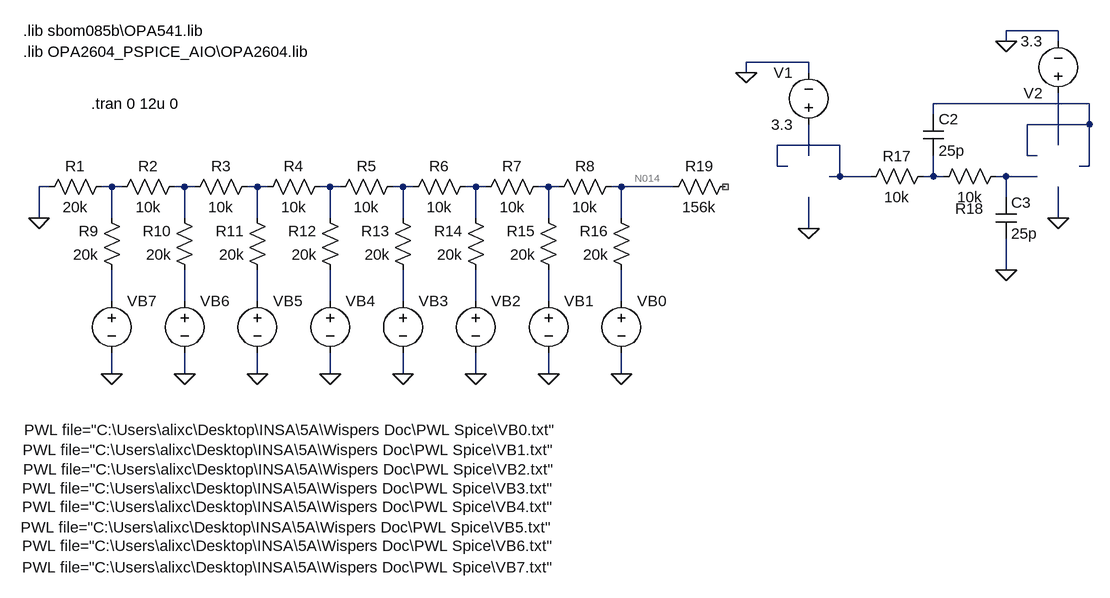
[diagram p0: schematic Transmission.asc]
Transmission.asc, the LTspice schematic file:
Version 4
SHEET 1 1856 1568
WIRE 1424 -128 1344 -128
WIRE 1344 -112 1344 -128
WIRE 1424 -112 1424 -128
WIRE 1040 -80 944 -80
WIRE 944 -64 944 -80
WIRE 1040 -64 1040 -80
WIRE 1472 -16 1232 -16
WIRE 1232 0 1232 -16
WIRE 1472 16 1472 -16
WIRE 1472 16 1376 16
WIRE 1088 48 992 48
WIRE 1424 48 1424 -32
WIRE 1040 64 1040 16
WIRE 1376 64 1376 16
WIRE 1392 64 1376 64
WIRE 992 80 992 48
WIRE 1008 80 992 80
WIRE 1472 80 1472 16
WIRE 1472 80 1456 80
WIRE 1088 96 1088 48
WIRE 1088 96 1072 96
WIRE 1136 96 1088 96
WIRE 1232 96 1232 64
WIRE 1232 96 1216 96
WIRE 1248 96 1232 96
WIRE 1344 96 1328 96
WIRE 1392 96 1344 96
WIRE -128 112 -144 112
WIRE -32 112 -48 112
WIRE -16 112 -32 112
WIRE 80 112 64 112
WIRE 96 112 80 112
WIRE 192 112 176 112
WIRE 208 112 192 112
WIRE 304 112 288 112
WIRE 320 112 304 112
WIRE 416 112 400 112
WIRE 432 112 416 112
WIRE 528 112 512 112
WIRE 544 112 528 112
WIRE 640 112 624 112
WIRE 656 112 640 112
WIRE 752 112 736 112
WIRE 832 112 752 112
WIRE 1344 128 1344 96
WIRE -144 160 -144 112
WIRE -32 160 -32 112
WIRE 80 160 80 112
WIRE 192 160 192 112
WIRE 304 160 304 112
WIRE 416 160 416 112
WIRE 528 160 528 112
WIRE 640 160 640 112
WIRE 752 160 752 112
WIRE 1424 160 1424 112
WIRE 1040 176 1040 128
WIRE 1344 240 1344 192
WIRE -32 288 -32 240
WIRE 80 288 80 240
WIRE 192 288 192 240
WIRE 304 288 304 240
WIRE 416 288 416 240
WIRE 528 288 528 240
WIRE 640 288 640 240
WIRE 752 288 752 240
WIRE -32 400 -32 368
WIRE 80 400 80 368
WIRE 192 400 192 368
WIRE 304 400 304 368
WIRE 416 400 416 368
WIRE 528 400 528 368
WIRE 640 400 640 368
WIRE 752 400 752 368
FLAG -144 160 0
FLAG 752 400 0
FLAG 640 400 0
FLAG 528 400 0
FLAG 416 400 0
FLAG 304 400 0
FLAG 192 400 0
FLAG 80 400 0
FLAG -32 400 0
FLAG 1344 240 0
FLAG 944 -64 0
FLAG 1344 -112 0
FLAG 1040 176 0
FLAG 1424 160 0
SYMBOL res -32 96 R90
WINDOW 0 0 56 VBottom 2
WINDOW 3 32 56 VTop 2
SYMATTR InstName R1
SYMATTR Value 20k
SYMBOL res 80 96 R90
WINDOW 0 0 56 VBottom 2
WINDOW 3 32 56 VTop 2
SYMATTR InstName R2
SYMATTR Value 10k
SYMBOL res 192 96 R90
WINDOW 0 0 56 VBottom 2
WINDOW 3 32 56 VTop 2
SYMATTR InstName R3
SYMATTR Value 10k
SYMBOL res 304 96 R90
WINDOW 0 0 56 VBottom 2
WINDOW 3 32 56 VTop 2
SYMATTR InstName R4
SYMATTR Value 10k
SYMBOL res 416 96 R90
WINDOW 0 0 56 VBottom 2
WINDOW 3 32 56 VTop 2
SYMATTR InstName R5
SYMATTR Value 10k
SYMBOL res 528 96 R90
WINDOW 0 0 56 VBottom 2
WINDOW 3 32 56 VTop 2
SYMATTR InstName R6
SYMATTR Value 10k
SYMBOL res 640 96 R90
WINDOW 0 0 56 VBottom 2
WINDOW 3 32 56 VTop 2
SYMATTR InstName R7
SYMATTR Value 10k
SYMBOL res 752 96 R90
WINDOW 0 0 56 VBottom 2
WINDOW 3 32 56 VTop 2
SYMATTR InstName R8
SYMATTR Value 10k
SYMBOL res -16 256 R180
WINDOW 0 36 76 Left 2
WINDOW 3 36 40 Left 2
SYMATTR InstName R9
SYMATTR Value 20k
SYMBOL res 96 256 R180
WINDOW 0 36 76 Left 2
WINDOW 3 36 40 Left 2
SYMATTR InstName R10
SYMATTR Value 20k
SYMBOL res 208 256 R180
WINDOW 0 36 76 Left 2
WINDOW 3 36 40 Left 2
SYMATTR InstName R11
SYMATTR Value 20k
SYMBOL res 320 256 R180
WINDOW 0 36 76 Left 2
WINDOW 3 36 40 Left 2
SYMATTR InstName R12
SYMATTR Value 20k
SYMBOL res 432 256 R180
WINDOW 0 36 76 Left 2
WINDOW 3 36 40 Left 2
SYMATTR InstName R13
SYMATTR Value 20k
SYMBOL res 544 256 R180
WINDOW 0 36 76 Left 2
WINDOW 3 36 40 Left 2
SYMATTR InstName R14
SYMATTR Value 20k
SYMBOL res 656 256 R180
WINDOW 0 36 76 Left 2
WINDOW 3 36 40 Left 2
SYMATTR InstName R15
SYMATTR Value 20k
SYMBOL res 768 256 R180
WINDOW 0 36 76 Left 2
WINDOW 3 36 40 Left 2
SYMATTR InstName R16
SYMATTR Value 20k
SYMBOL voltage -32 272 R0
WINDOW 3 -135 214 Left 2
WINDOW 123 0 0 Left 0
WINDOW 39 0 0 Left 0
SYMATTR Value PWL file="C:\Users\alixc\Desktop\INSA\5A\Wispers Doc\PWL Spice\VB0.txt"
SYMATTR InstName VB7
SYMBOL voltage 80 272 R0
WINDOW 3 -249 245 Left 2
WINDOW 123 0 0 Left 0
WINDOW 39 0 0 Left 0
SYMATTR Value PWL file="C:\Users\alixc\Desktop\INSA\5A\Wispers Doc\PWL Spice\VB1.txt"
SYMATTR InstName VB6
SYMBOL voltage 192 272 R0
WINDOW 3 -360 275 Left 2
WINDOW 123 0 0 Left 0
WINDOW 39 0 0 Left 0
SYMATTR Value PWL file="C:\Users\alixc\Desktop\INSA\5A\Wispers Doc\PWL Spice\VB2.txt"
SYMATTR InstName VB5
SYMBOL voltage 304 272 R0
WINDOW 3 -474 304 Left 2
WINDOW 123 0 0 Left 0
WINDOW 39 0 0 Left 0
SYMATTR Value PWL file="C:\Users\alixc\Desktop\INSA\5A\Wispers Doc\PWL Spice\VB3.txt"
SYMATTR InstName VB4
SYMBOL voltage 416 272 R0
WINDOW 3 -586 333 Left 2
WINDOW 123 0 0 Left 0
WINDOW 39 0 0 Left 0
SYMATTR Value PWL file="C:\Users\alixc\Desktop\INSA\5A\Wispers Doc\PWL Spice\VB4.txt"
SYMATTR InstName VB3
SYMBOL voltage 528 272 R0
WINDOW 3 -700 364 Left 2
WINDOW 123 0 0 Left 0
WINDOW 39 0 0 Left 0
SYMATTR Value PWL file="C:\Users\alixc\Desktop\INSA\5A\Wispers Doc\PWL Spice\VB5.txt"
SYMATTR InstName VB2
SYMBOL voltage 640 272 R0
WINDOW 3 -810 393 Left 2
WINDOW 123 0 0 Left 0
WINDOW 39 0 0 Left 0
SYMATTR Value PWL file="C:\Users\alixc\Desktop\INSA\5A\Wispers Doc\PWL Spice\VB6.txt"
SYMATTR InstName VB1
SYMBOL voltage 752 272 R0
WINDOW 3 -922 426 Left 2
WINDOW 123 0 0 Left 0
WINDOW 39 0 0 Left 0
SYMATTR Value PWL file="C:\Users\alixc\Desktop\INSA\5A\Wispers Doc\PWL Spice\VB7.txt"
SYMATTR InstName VB0
SYMBOL res 1232 80 R90
WINDOW 0 0 56 VBottom 2
WINDOW 3 32 56 VTop 2
SYMATTR InstName R17
SYMATTR Value 10k
SYMBOL res 1344 80 R90
WINDOW 0 81 56 VBottom 2
WINDOW 3 32 56 VTop 2
SYMATTR InstName R18
SYMATTR Value 10k
SYMBOL cap 1216 0 R0
SYMATTR InstName C2
SYMATTR Value 25p
SYMBOL cap 1328 128 R0
SYMATTR InstName C3
SYMATTR Value 25p
SYMBOL voltage 1040 32 R180
WINDOW 0 24 96 Left 2
WINDOW 3 24 16 Left 2
WINDOW 123 0 0 Left 0
WINDOW 39 0 0 Left 0
SYMATTR InstName V1
SYMATTR Value 3.3
SYMBOL voltage 1424 -16 R180
WINDOW 123 0 0 Left 0
WINDOW 39 0 0 Left 0
SYMATTR InstName V2
SYMATTR Value 3.3
SYMBOL res 928 96 R90
WINDOW 0 0 56 VBottom 2
WINDOW 3 32 56 VTop 2
SYMATTR InstName R19
SYMATTR Value 156k
TEXT -64 -16 Left 2 !.tran 0 12u 0
TEXT -168 -128 Left 2 !.lib sbom085b\\OPA541.lib
TEXT -168 -96 Left 2 !.lib OPA2604_PSPICE_AIO\\OPA2604.lib

The netlist it stands for:
* Transmission.asc
R1 N007 0 20k
R2 N008 N007 10k
R3 N009 N008 10k
R4 N010 N009 10k
R5 N011 N010 10k
R6 N012 N011 10k
R7 N013 N012 10k
R8 N014 N013 10k
R9 N015 N007 20k
R10 N016 N008 20k
R11 N017 N009 20k
R12 N018 N010 20k
R13 N019 N011 20k
R14 N020 N012 20k
R15 N021 N013 20k
R16 N022 N014 20k
VB7 N015 0 PWL file="C:\Users\alixc\Desktop\INSA\5A\Wispers Doc\PWL Spice\VB0.txt"
VB6 N016 0 PWL file="C:\Users\alixc\Desktop\INSA\5A\Wispers Doc\PWL Spice\VB1.txt"
VB5 N017 0 PWL file="C:\Users\alixc\Desktop\INSA\5A\Wispers Doc\PWL Spice\VB2.txt"
VB4 N018 0 PWL file="C:\Users\alixc\Desktop\INSA\5A\Wispers Doc\PWL Spice\VB3.txt"
VB3 N019 0 PWL file="C:\Users\alixc\Desktop\INSA\5A\Wispers Doc\PWL Spice\VB4.txt"
VB2 N020 0 PWL file="C:\Users\alixc\Desktop\INSA\5A\Wispers Doc\PWL Spice\VB5.txt"
VB1 N021 0 PWL file="C:\Users\alixc\Desktop\INSA\5A\Wispers Doc\PWL Spice\VB6.txt"
VB0 N022 0 PWL file="C:\Users\alixc\Desktop\INSA\5A\Wispers Doc\PWL Spice\VB7.txt"
R17 N005 N002 10k
R18 N006 N005 10k
C2 N001 N005 25p
C3 N006 0 25p
V1 N004 0 3.3
V2 N003 0 3.3
R19 NC_01 N014 156k
.tran 0 12u 0
.lib sbom085b\OPA541.lib
.lib OPA2604_PSPICE_AIO\OPA2604.lib
.backanno
.end

* Results of the author's LTspice run, read from the files saved beside the schematic
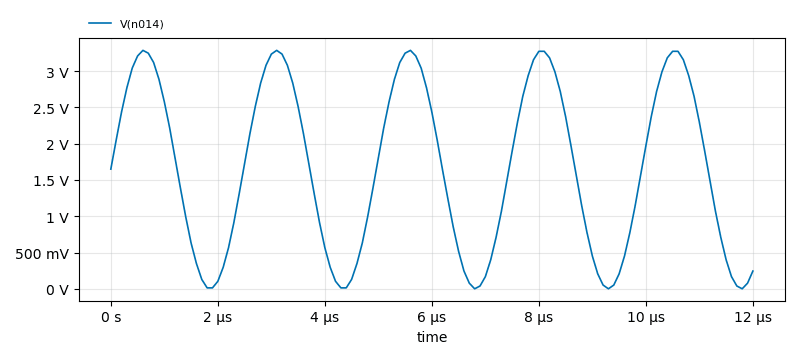
[diagram p1: Transient Analysis of Transmission.asc, plotted from the saved traces]
* Transient Analysis, 1 run:
*   V(n014): min 0 V, max 3.287 V, average 1.669 V, rms 2.038 V, last 244.9 mV